# EAGLE design butt-on-mk-1.0 (EAGLE 6.5.0)
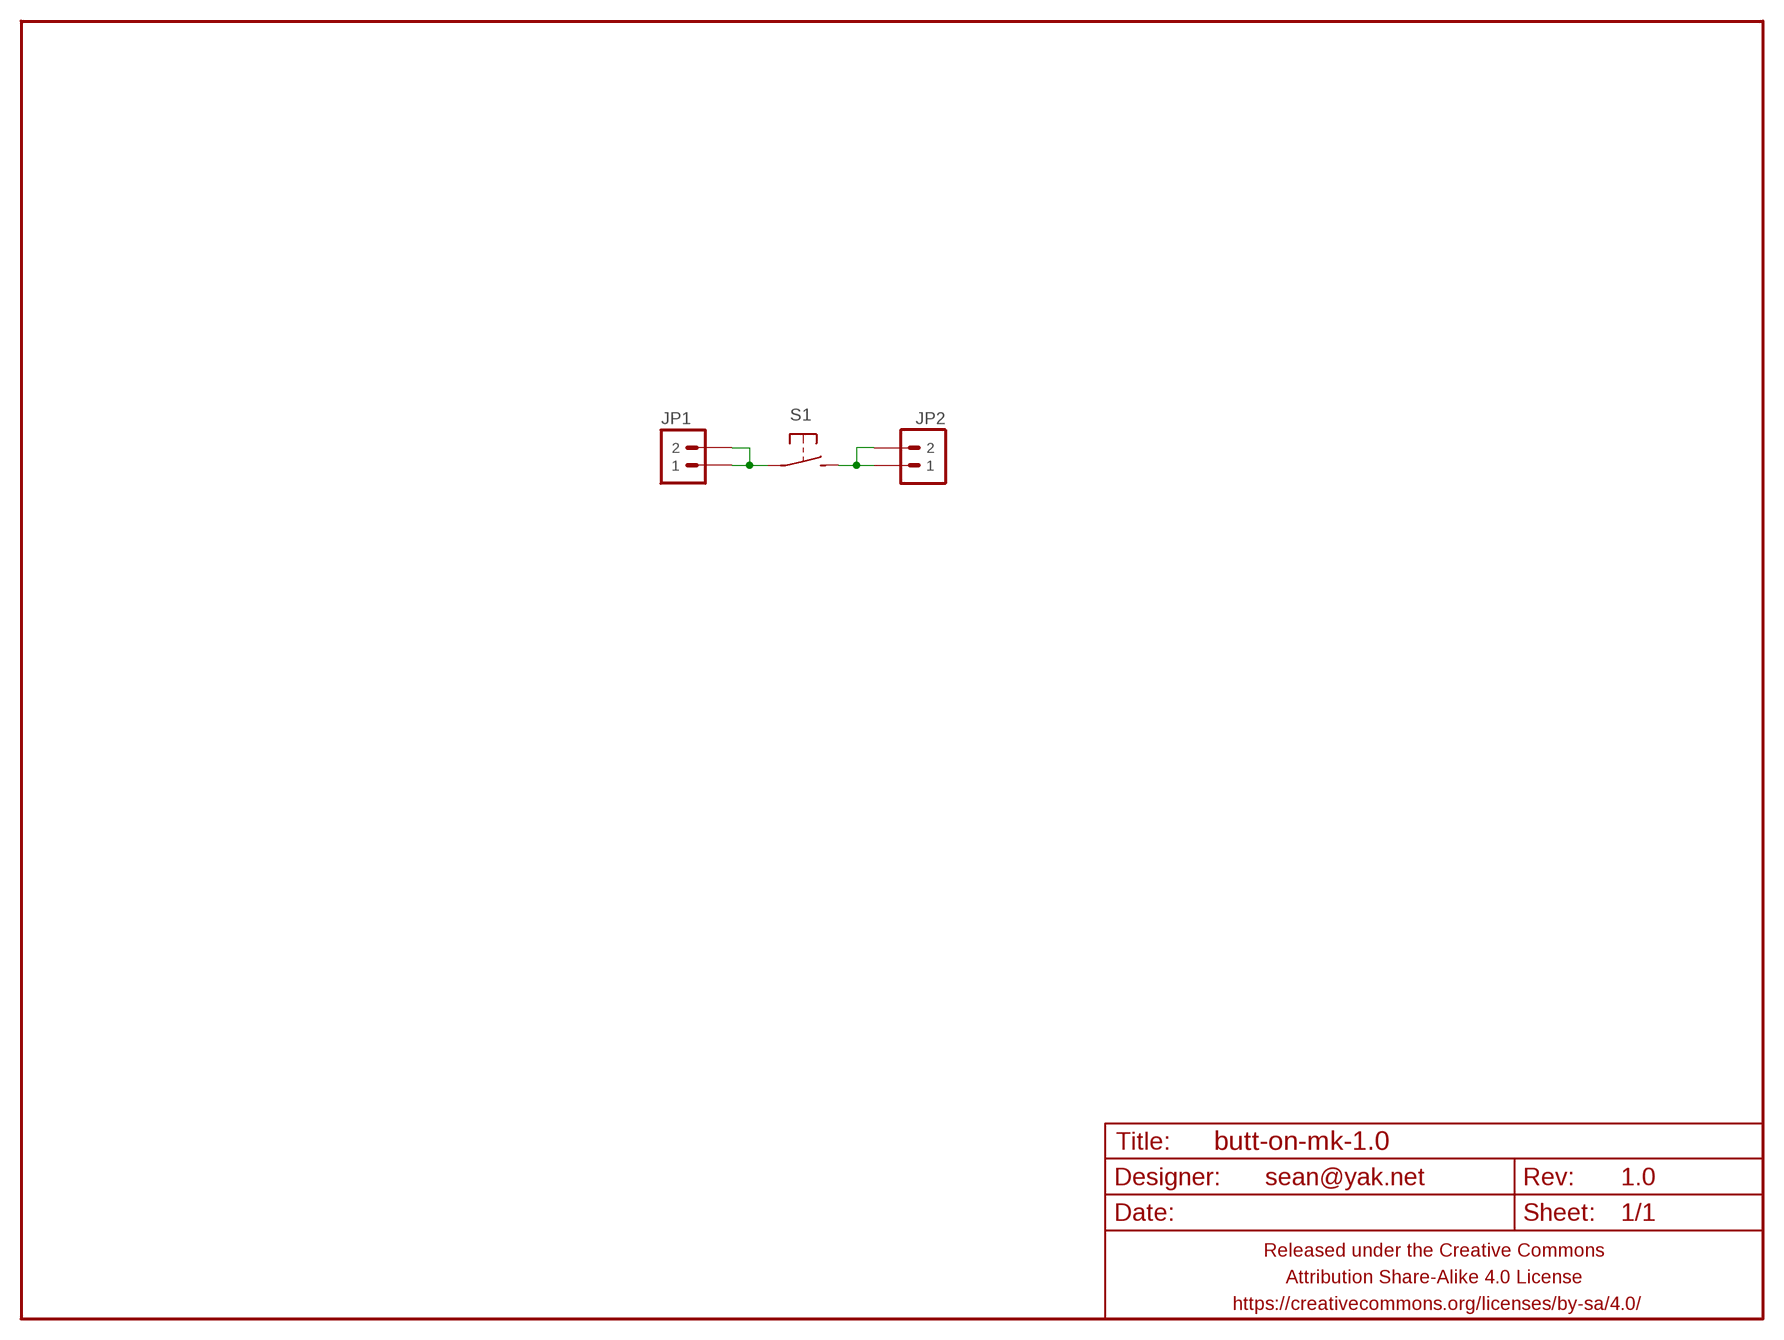
[diagram p0: schematic, sheet 1]

## Parts
FRAME1  FRAME-LETTERNO_PACKAGE  [DUMMY]
JP1  M02PTH-CENTERED  [1X02-CENTER]
JP2  M02PTH-CENTERED  [1X02-CENTER]
S1  SPST-NO-TACT3MM-PTH-SMALL-PADS  [DTS-3-SMALL-PADS]

## Nets
N$1: JP1.1 JP1.2 S1.1
N$3: JP2.1 JP2.2 S1.2

## Library data of the parts
FRAME1 = A_butts:FRAME-LETTER: Schematic Frame Standard 8.5x11 US Letter frame; DESIGNER: sean@yak.net; VERSION: 1.0
JP1 JP2 = A_butts:M02: Standard 2-pin 0.1" header. Use with - straight break away headers ( PRT-00116) - right angle break away headers (PRT-00553) - swiss pins (PRT-00743) - machine pins (PRT-00117) - female headers (PRT-00115) Molex polarized connector foot print use with: PRT-08233 with associated crimp pins and housings. 2.54_SCREWTERM for use with PRT-10571. 3.5mm Screw Terminal footprints for PRT-08084 5mm Screw Terminal footprints for use with PRT-08433
S1 = A_butts:SPST-NO-TACT

## Board
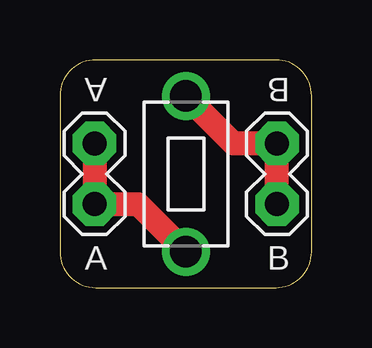
[diagram p1: board, top side]

Size 10.5 x 9.5 mm. Coordinates in mm from the lower left corner, seen from the top.
Outline: 0,8 0,1.5 arc90 1.5,0 9,0 arc90 10.5,1.5 10.5,8 arc90 9,9.5 1.5,9.5 arc90 0,8
Copper layers (1*16): Top 0.0356mm / dielectric 1.5011mm / Bottom 0.0356mm
Design rules "LaenPCBOrder2": minimum track width 6mil, minimum drill 13mil, track to track 6mil, track to pad 6mil, pad to pad 6mil, via to via 6mil, smd to smd 6mil, copper to edge 15mil, drill to drill 6mil, minimum pad ring 7mil, minimum via ring 7mil, stop-mask expansion 3mil, vias tented up to drill 20mil, thermal gap 10mil

### Footprints (pad centres in the part's own frame; a part is rotated, then mirrored left to right if it is on the bottom)
1X02-CENTER = drill 1 pad 1.8 octagon: 1 -1.27,0; 2 1.27,0
DTS-3-SMALL-PADS = drill 1.3 pad 2: 1 -3.25,0; 2 3.25,0

### Placement (x,y rotation side)
FRAME1  0,0 0 top
JP1  1.44,4.75 90 top
JP2  9.06,4.75 90 top
S1  5.25,4.75 90 top

### Tracks (layer width: path | path; a pad name or v marks a point on that pad's centre or on a via)
N$1
  Top 1: JP1.2 JP1.1 3.27,3.48 S1.1
N$3
  Top 1: JP2.1 JP2.2 7.23,6.02 S1.2

### Text on the board
tPlace: A | B | A | B